# Altium schematic sheet Interfaces.SchDoc: Raspberry Pi Interface
size A3; CompanyName: FSCH; DrawnBy: ahorat / daniw; Engineer: ahorat / daniw; Address1: FS Switzerland; Address2: Zeltweg 57; Address3: 8032 Zürich; SheetNumber: 7; SheetTotal: 9
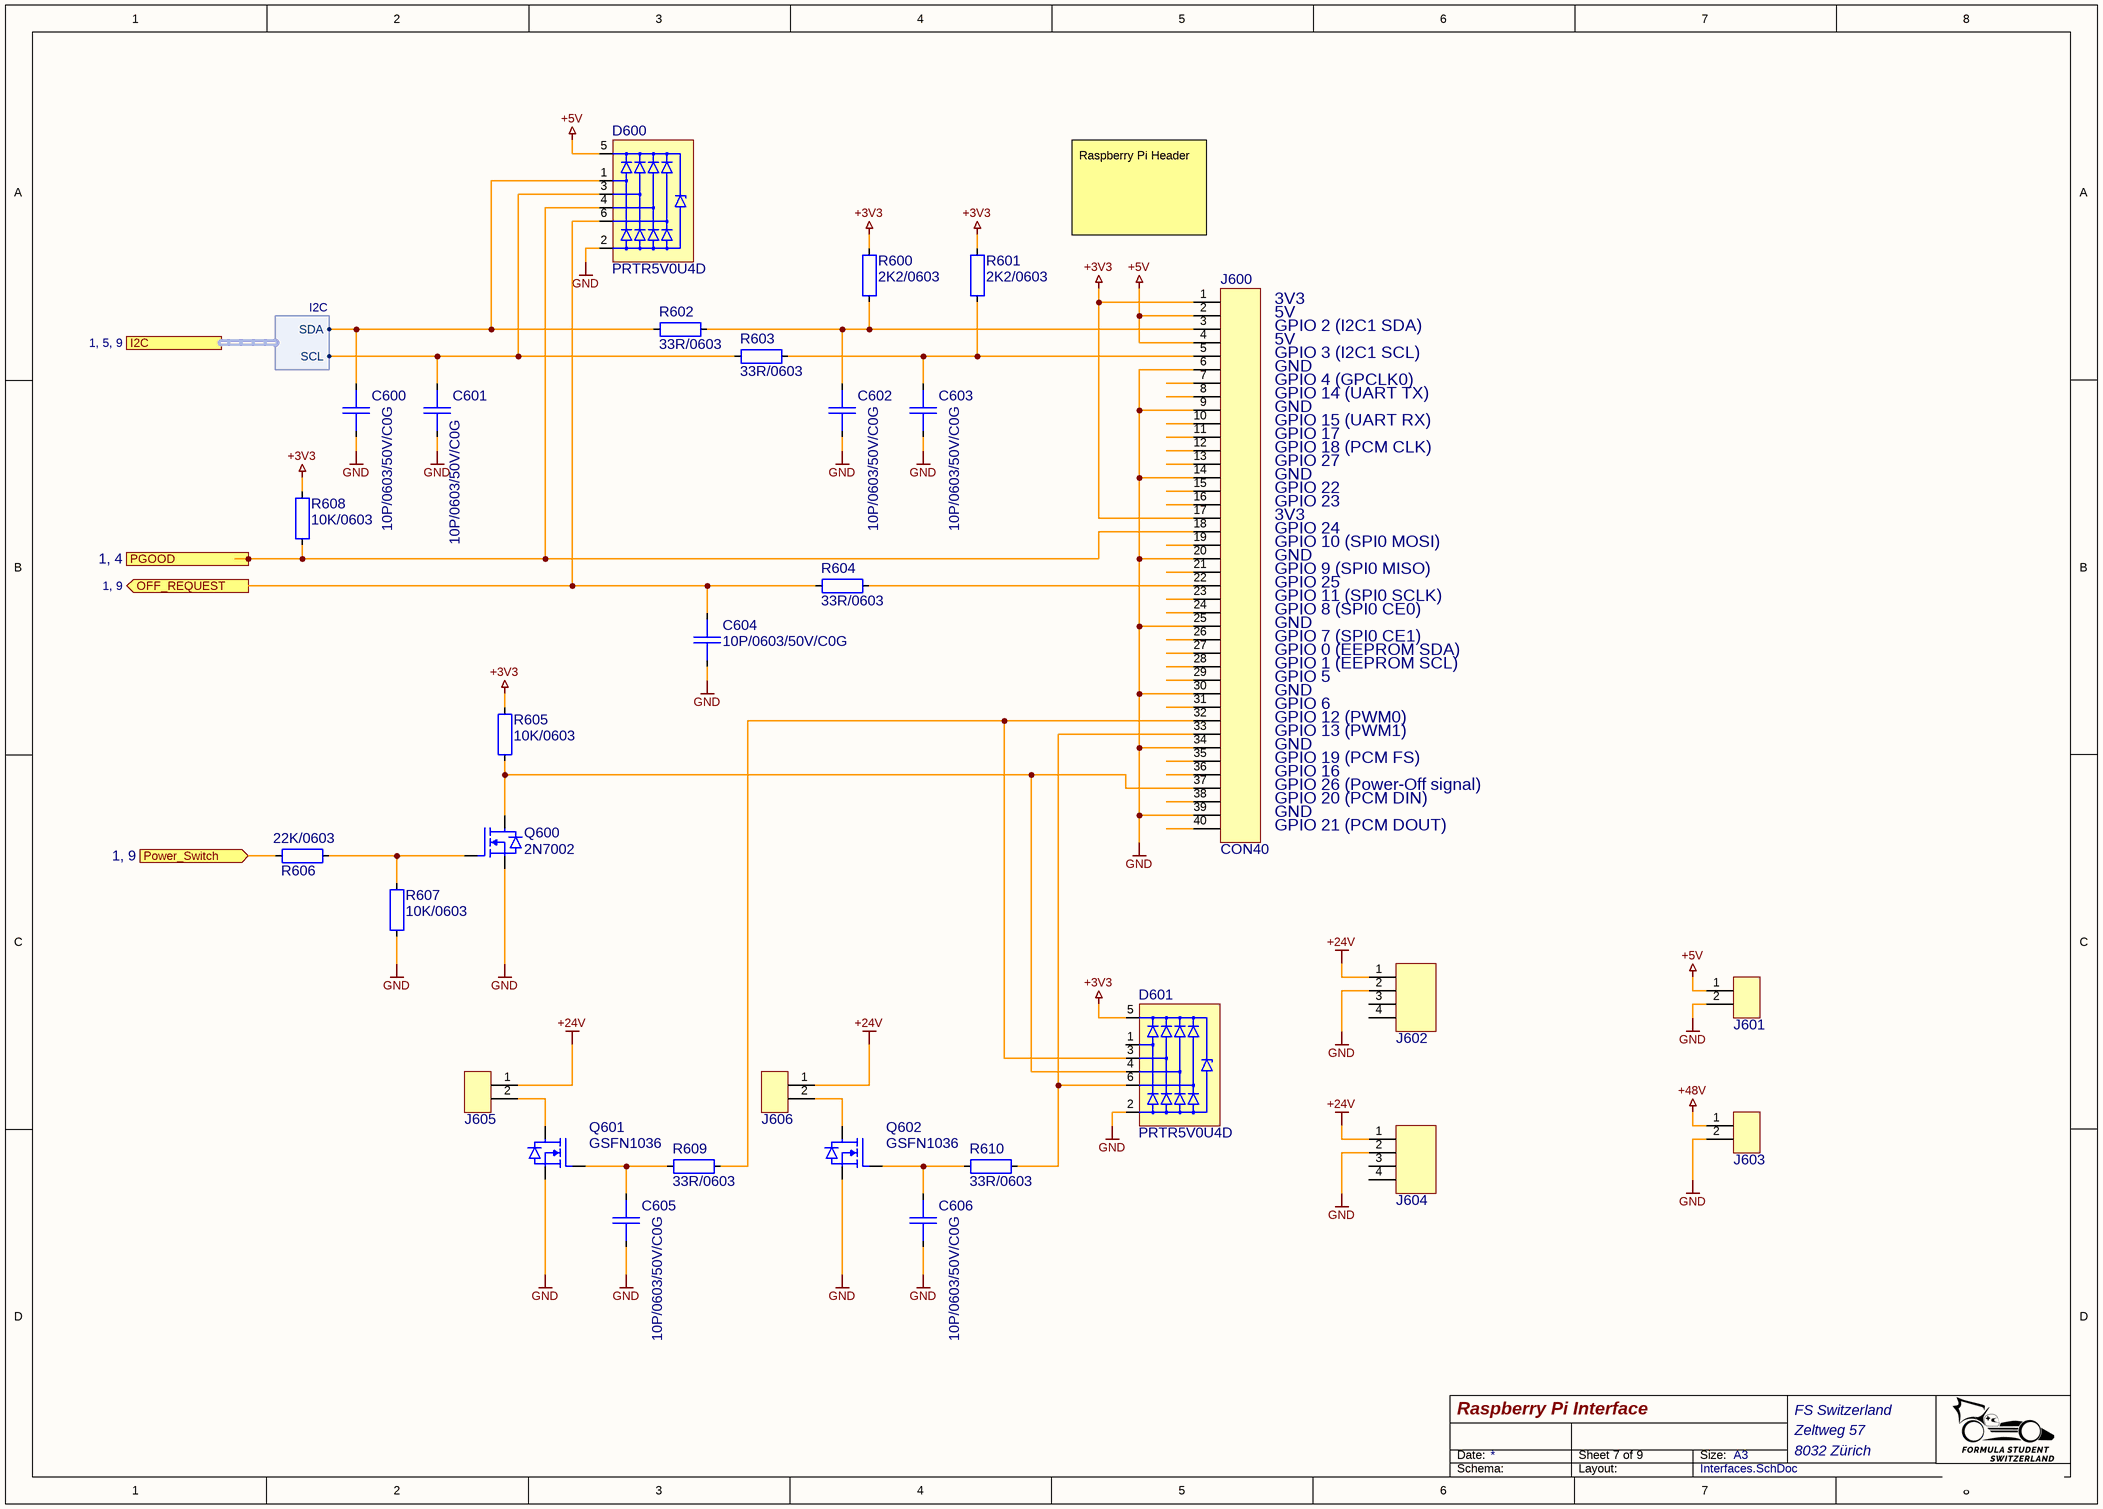
[diagram p0: Interfaces.SchDoc]

## Parts
C600  10P/0603/50V/C0G  [CAP0603_C0G]
C601  10P/0603/50V/C0G  [CAP0603_C0G]
C602  10P/0603/50V/C0G  [CAP0603_C0G]
C603  10P/0603/50V/C0G  [CAP0603_C0G]
C604  10P/0603/50V/C0G  [CAP0603_C0G]
C605  10P/0603/50V/C0G  [CAP0603_C0G]
C606  10P/0603/50V/C0G  [CAP0603_C0G]
D600  PRTR5V0U4D  [SOT2395P280X125-6-NW]
D601  PRTR5V0U4D  [SOT2395P280X125-6-NW]
J600  CON40  [HEAD_254_2X20_Tray]
J601  5600200220  [5600200220]  (value not drawn)
J602  430450412  [430450412]  (value not drawn)
J603  430450212  [430450212]  (value not drawn)
J604  430450412  [430450412]  (value not drawn)
J605  5600200220  [5600200220]  (value not drawn)
J606  5600200220  [5600200220]  (value not drawn)
Q600  2N7002  [SOT2395P280X125-3-SE]
Q601  GSFN1036  [SON065P330X330X075-5-TH245X175]
Q602  GSFN1036  [SON065P330X330X075-5-TH245X175]
R600  2K2/0603  [R0603-0.40-WW]
R601  2K2/0603  [R0603-0.40-WW]
R602  33R/0603  [R0603-0.40-WW]
R603  33R/0603  [R0603-0.40-WW]
R604  33R/0603  [R0603-0.40-WW]
R605  10K/0603  [R0603-0.40-WW]
R606  22K/0603  [R0603-0.40-WW]
R607  10K/0603  [R0603-0.40-WW]
R608  10K/0603  [R0603-0.40-WW]
R609  33R/0603  [R0603-0.40-WW]
R610  33R/0603  [R0603-0.40-WW]

## Ports
I2C (harness I2C, see 1, 5, 9), OFF_REQUEST (out, see 1, 9), PGOOD (in, see 1, 4), Power_Switch (in, see 1, 9)

## Harnesses
I2C: SDA, SCL

## Nets
+3V3: D601.5 J600.1 J600.17 R600.2 R601.2 R605.1 R608.1
+5V: D600.5 J600.2 J600.4 J601.1
+24V: J602.1 J604.1 J605.1 J606.1
+48V: J603.1
GND: C600.2 C601.2 C602.2 C603.2 C604.2 C605.2 C606.2 D600.2 D601.2 J600.6 J600.9 J600.14 J600.20 J600.25 J600.30 J600.34 J600.39 J601.2 J602.2 J603.2 J604.2 Q600.2(SOURCE) Q601.S(SOURCE) Q602.S(SOURCE) R607.2
OFF_REQUEST: C604.1 D600.6 R604.1 ; port OFF_REQUEST
PGOOD: D600.4 J600.18 R608.2 ; port PGOOD
Power_Switch: R606.1 ; port Power_Switch
NetC600_1: C600.1 D600.1 R602.1 ; port I2C.SDA
NetC601_1: C601.1 D600.3 R603.1 ; port I2C.SCL
NetC602_1: C602.1 J600.3 R600.1 R602.2
NetC603_1: C603.1 J600.5 R601.1 R603.2
NetC605_1: C605.1 Q601.G(GATE) R609.1
NetC606_1: C606.1 Q602.G(GATE) R610.1
NetD601_3: D601.3 J600.32 R609.2
NetD601_4: D601.4 J600.37 Q600.3(DRAIN) R605.2
NetD601_6: D601.6 J600.33 R610.2
NetJ600_22: J600.22 R604.2
NetJ605_2: J605.2 Q601.D(DRAIN)
NetJ606_2: J606.2 Q602.D(DRAIN)
NetQ600_1: Q600.1(GATE) R606.2 R607.1

Not connected (* = marked no-connect by the designer): D601 1; J600 7 8 10 11 12 13 15 16 19 21 23 24 26 27 28 29 31 35 36 38 40; J602 3 4; J604 3 4

## Notes on the sheet
- Raspberry Pi Header
- 3V3
- 5V
- GPIO 2 (I2C1 SDA)
- GPIO 3 (I2C1 SCL)
- GND
- GPIO 4 (GPCLK0)
- GPIO 14 (UART TX)
- GPIO 15 (UART RX)
- GPIO 17
- GPIO 18 (PCM CLK)
- GPIO 27
- GPIO 22
- GPIO 23
- GPIO 24
- GPIO 10 (SPI0 MOSI)
- GPIO 9 (SPI0 MISO)
- GPIO 25
- GPIO 11 (SPI0 SCLK)
- GPIO 8 (SPI0 CE0)
- GPIO 7 (SPI0 CE1)
- GPIO 0 (EEPROM SDA)
- GPIO 1 (EEPROM SCL)
- GPIO 5
- GPIO 6
- GPIO 12 (PWM0)
- GPIO 13 (PWM1)
- GPIO 19 (PCM FS)
- GPIO 16
- GPIO 26 (Power-Off signal)
- GPIO 20 (PCM DIN)
- GPIO 21 (PCM DOUT)
- Date:
- Size:
- A3
- Schema:
- Layout:

## Library data of the parts
C600-C606 = 10P/0603/50V/C0G: CAP SM 0603 10pF 50V C0G; Manufacturer: GENERIC; Manufacturer 1: YAGEO; Manufacturer Part Number 1: CC0603JRNPO9BN100; Absolute Value: 1E-11; Eurocircuits GPN: GPC0603100-C0G; Part Number: 10P/0603/50V/C0G; Package: 0603; Value: 10pF; HelpURL: https://www.yageo.com/upload/media/product/productsearch/datasheet/mlcc/UPY-GP_NP0_16V-to-50V_18.pdf; Supplier 1: Digi-Key; Supplier Part Number 1: 311-1058-1-ND; Manufacturer 2: YAGEO; Manufacturer Part Number 2: CC0603KRNPO9BN100; Supplier 2: Digi-Key; Supplier Part Number 2: 311-4025-1-ND
D600 D601 = PRTR5V0U4D: quadruple rail-to-rail ESD protection 5V; Manufacturer: Nexperia; Manufacturer 1: Nexperia USA Inc.; Manufacturer Part Number 1: PRTR5V0U4D,125; Part Number: PRTR5V0U4D; Package: SC74 SOT-457; Value: PRTR5V0U4D; Absolute Value: 5V; HelpURL: https://assets.nexperia.com/documents/data-sheet/PRTR5V0U4D.pdf; Supplier 1: Digikey; Supplier Part Number 1: 1727-3890-1-ND
J600 = Header_2x20_Tray: Header 100 mil; Manufacturer: GENERIC; Manufacturer 1: On Shore Technology Inc.; Manufacturer Part Number 1: 302-S401; Part Number: Header_2x20_Tray; HelpURL: https://mm.digikey.com/Volume0/opasdata/d220001/medias/docus/6025/302-S.pdf; Supplier 1: Digi-Key; Supplier Part Number 1: ED10529-ND
J601 J605 J606 = DuraClick_1x2_VERT_SMD: DuraClik Wire-to-Board Header, Single Row, Vertical, 2 Circuits, Tin (Sn) Over Nickel, Natural; Manufacturer 1: Molex; Part Number: DuraClick_1x2_VERT_SMD; HelpURL: https://www.molex.com/en-us/products/part-detail/5600200220; Manufacturer Part Number 1: 5600200220; Supplier 1: Digi-Key; Supplier Part Number 1: WM10862CT-ND; Manufacturer: Molex
J602 J604 = Microfit_3.0_2x2_VERT_THT: Micro-Fit 3.0 Vertical Header, 3.00mm Pitch, Dual Row, 4 Circuits, with PCB Polarizing Peg, Tin, Glow-Wire Capable, Black; Manufacturer 1: Molex; Part Number: Microfit_3.0_2x2_VERT_THT; HelpURL: https://tools.molex.com/pdm_docs/sd/430450412_sd.pdf; Manufacturer Part Number 1: 430450412; Supplier 1: Digi-Key; Supplier Part Number 1: WM1790-ND
J603 = Microfit_3.0_1x2_VERT_THT: Micro-Fit 3.0 Vertical Header, 3.00mm Pitch, Dual Row, 2 Circuits, with PCB Polarizing Peg, Tin, Glow-Wire Capable, Black; Manufacturer 1: Molex; Part Number: Microfit_3.0_1x2_VERT_THT; HelpURL: https://tools.molex.com/pdm_docs/ps/PS-43045.pdf; Manufacturer Part Number 1: 430450212; Supplier 1: Digi-Key; Supplier Part Number 1: WM1789-ND
Q600 = 2N7002: 60V 115mA 1.2Ω@10V,500mA 200mW 2.1V@250uA N Channel SOT-23 MOSFETs; Manufacturer: GENERIC; Manufacturer 1: Nexperia USA Inc.; Manufacturer Part Number 1: 2N7002NXAKR; Part Number: 2N7002; Package: SOT23; HelpURL: https://assets.nexperia.com/documents/data-sheet/2N7002NXAK.pdf; Supplier 1: Digi-Key; Supplier Part Number 1: 1727-8643-1-ND; Manufacturer 3: JSMSEMI; Manufacturer Part Number 3: JSMSEMI; Supplier 3: LCSC; Supplier Part Number 3: C916396; JLC Type: Extended
Q601 Q602 = GSFN1036: N-Kanal 100 V 35 A (Tc) 52W (Tc) Oberflächenmontage 8-PPAK (3,1x3,05); Manufacturer: Good-Ark Semiconductor; Part Number: GSFN1036; Package: 8-PowerVDFN; HelpURL: https://goodarksemi.com/docs/datasheets/mosfets/GSFN1036.pdf; Manufacturer 1: Good-Ark Semiconductor; Manufacturer Part Number 1: GSFN1036; Supplier 1: Digi-Key; Supplier Part Number 1: 4786-GSFN1036CT-ND
R600 R601 = 2K2/0603: RES SM 0603 2K2; Manufacturer: GENERIC; Manufacturer 1: YAGEO; Manufacturer Part Number 1: RC0603FR-132K2L; Absolute Value: 2200; Eurocircuits GPN: GPR06032K2; Part Number: 2K2/0603; Package: 0603; Value: 2K2; HelpURL: https://www.yageo.com/upload/media/product/app/datasheet/rchip/pyu-rc_group_51_rohs_l.pdf; Supplier 1: Digi-Key; Supplier Part Number 1: 13-RC0603FR-132K2LCT-ND; Manufacturer 2: YAGEO; Manufacturer Part Number 2: RC0603FR-102K2L; Supplier 2: Digi-Key; Supplier Part Number 2: 13-RC0603FR-102K2LCT-ND; Manufacturer 3: YAGEO; Manufacturer Part Number 3: RC0603JR-072K2L; Supplier 3: LCSC; Supplier Part Number 3: C113303
R602-R604 R609 R610 = 33R/0603: RES SM 0603 33R; Manufacturer: GENERIC; Manufacturer 1: YAGEO; Manufacturer Part Number 1: RC0603FR-1333RL; Absolute Value: 33; Eurocircuits GPN: GPR060333R; Part Number: 33R/0603; Package: 0603; Value: 33R; HelpURL: https://www.yageo.com/upload/media/product/app/datasheet/rchip/pyu-rc_group_51_rohs_l.pdf; Supplier 1: Digi-Key; Supplier Part Number 1: 13-RC0603FR-1333RLCT-ND; Manufacturer 2: YAGEO; Manufacturer Part Number 2: RC0603FR-1033RL; Supplier 2: Digi-Key; Supplier Part Number 2: 13-RC0603FR-1033RLCT-ND
R605 R607 R608 = 10K/0603: RES SM 0603 10K; Manufacturer: GENERIC; Manufacturer 1: YAGEO; Manufacturer Part Number 1: RC0603FR-1310KL; Absolute Value: 10000; Eurocircuits GPN: GPR060310K; Part Number: 10K/0603; Package: 0603; Value: 10K; HelpURL: https://www.yageo.com/upload/media/product/productsearch/datasheet/rchip/PYu-RC_Group_51_RoHS_L_12.pdf; Supplier 1: Digi-Key; Supplier Part Number 1: 13-RC0603FR-1310KLCT-ND; Manufacturer 2: YAGEO; Manufacturer Part Number 2: RC0603FR-1010KL; Supplier 2: Digi-Key; Supplier Part Number 2: 13-RC0603FR-1010KLCT-ND; Manufacturer 3: UNI-ROYAL(Uniroyal Elec); Manufacturer Part Number 3: 0603WAF1002T5E; Supplier 3: LCSC; Supplier Part Number 3: C25804; JLC Type: Basic
R606 = 22K/0603: RES SM 0603 22K; Manufacturer: GENERIC; Manufacturer 1: YAGEO; Manufacturer Part Number 1: RC0603FR-1322KL; Absolute Value: 22000; Eurocircuits GPN: GPR060322K; Part Number: 22K/0603; Package: 0603; Value: 22K; HelpURL: https://www.yageo.com/upload/media/product/app/datasheet/rchip/pyu-rc_group_51_rohs_l.pdf; Supplier 1: Digi-Key; Supplier Part Number 1: 13-RC0603FR-1322KLCT-ND; Manufacturer 2: YAGEO; Manufacturer Part Number 2: RC0603FR-1022KL; Supplier 2: Digi-Key; Supplier Part Number 2: 13-RC0603FR-1022KLCT-ND; Manufacturer 3: UNI-ROYAL(Uniroyal Elec); Manufacturer Part Number 3: 0603WAF2202T5E; Supplier 3: LCSC; Supplier Part Number 3: C31850; JLC Type: Basic